# EAGLE schematic VoltMeter (EAGLE 9.4.1)
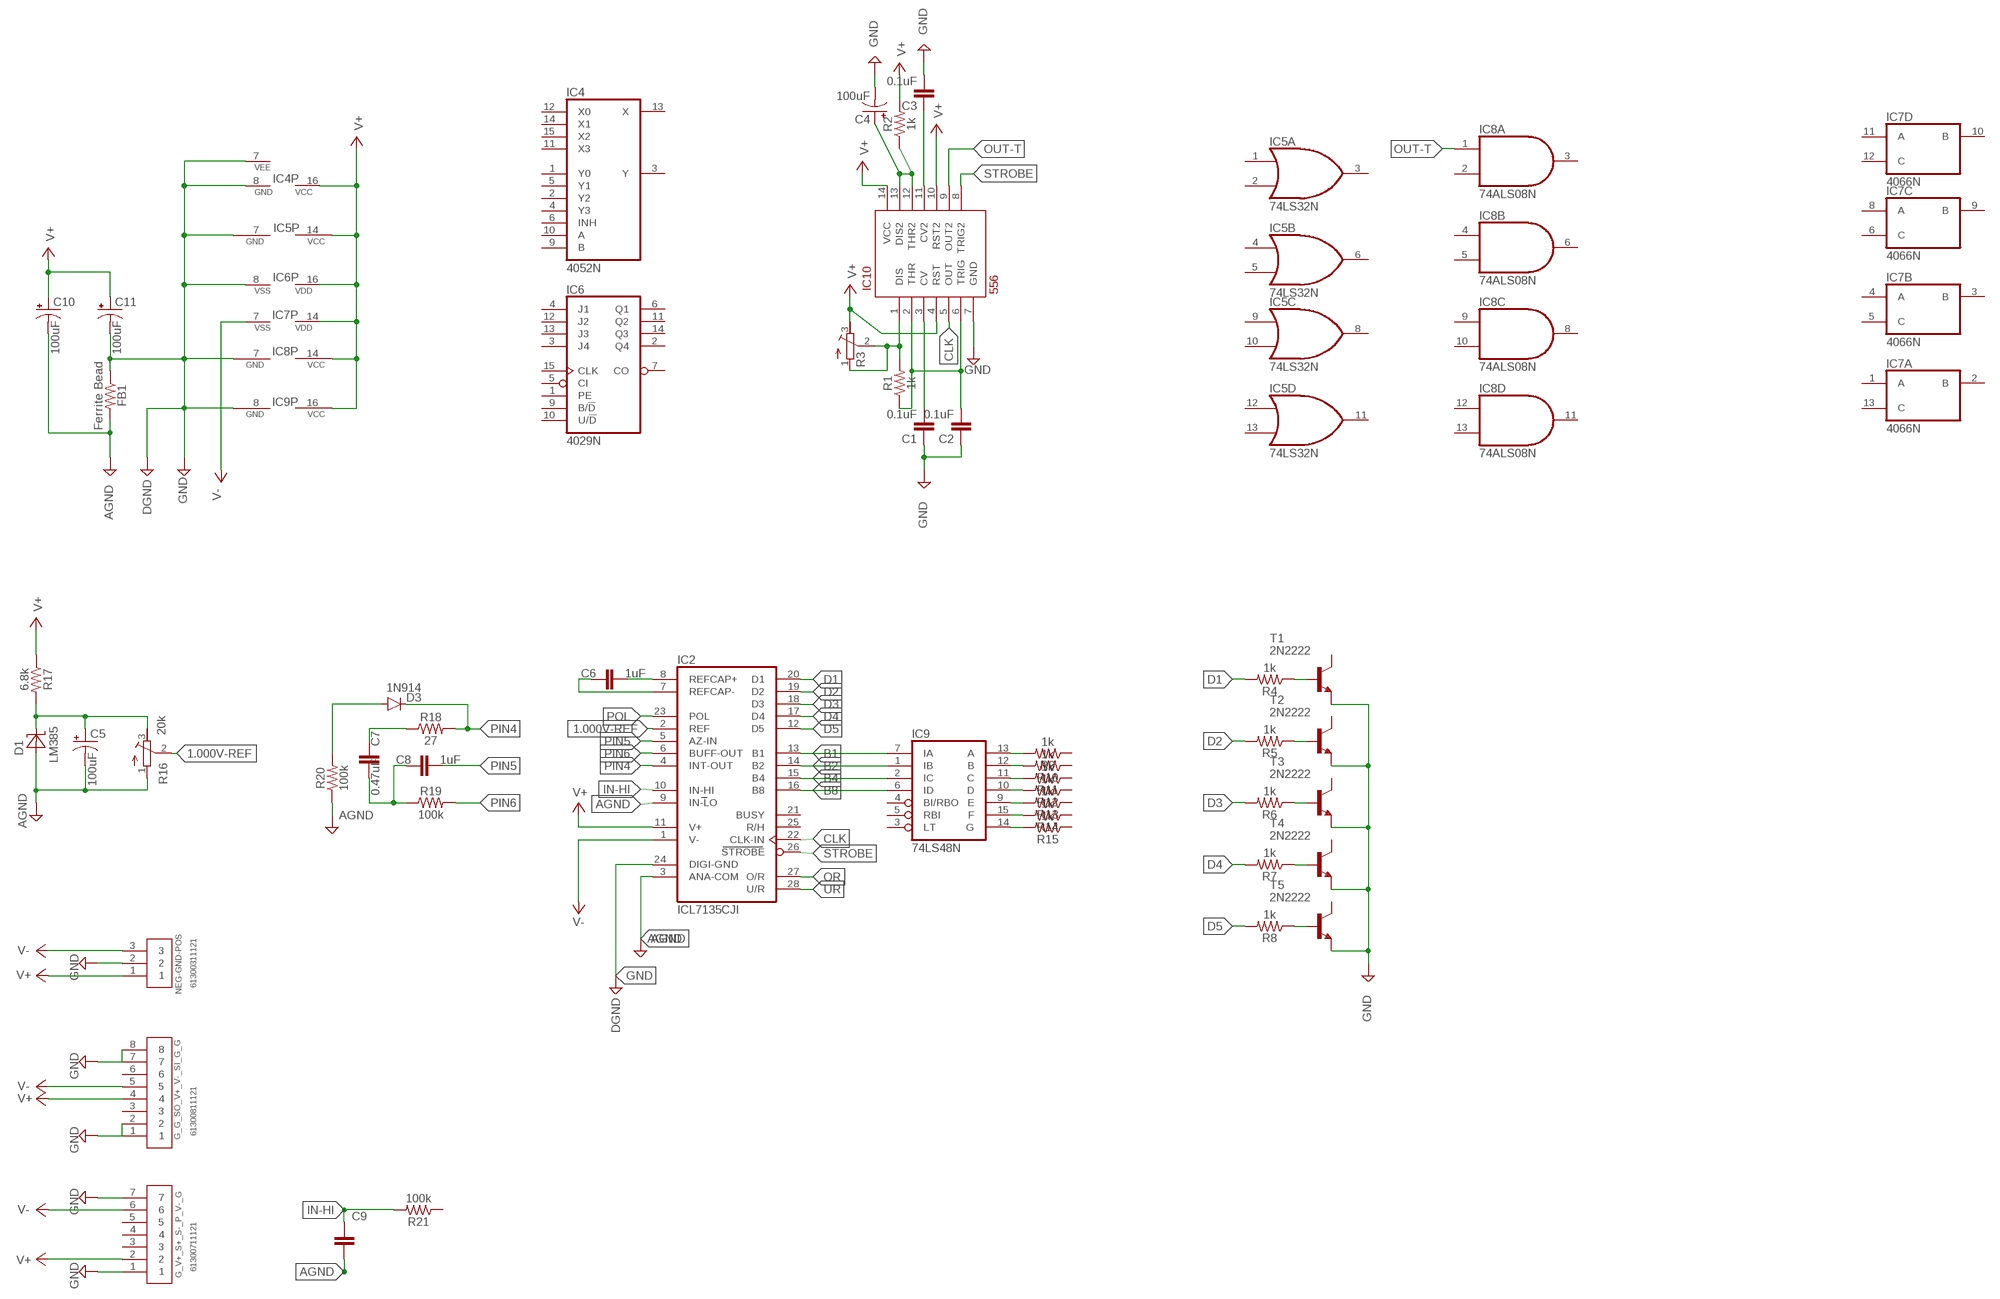
[diagram p0: schematic, sheet 1]

## Parts
C1  0.1uF  0.1UF-KIT-EZ-50V-20%  [CAP-PTH-SMALL-KIT]
C2  0.1uF  0.1UF-KIT-EZ-50V-20%  [CAP-PTH-SMALL-KIT]
C3  0.1uF  0.1UF-KIT-EZ-50V-20%  [CAP-PTH-SMALL-KIT]
C4  100uF  100UF-POLAR-RADIAL-2.5MM-25V-20%  [CPOL-RADIAL-2.5MM-6.5MM]
C5  100uF  100UF-POLAR-RADIAL-2.5MM-25V-20%  [CPOL-RADIAL-2.5MM-6.5MM]
C6  1uF  0.1UF-KIT-EZ-50V-20%  [CAP-PTH-SMALL-KIT]
C7  0.47uF  0.1UF-KIT-EZ-50V-20%  [CAP-PTH-SMALL-KIT]
C8  1uF  0.1UF-KIT-EZ-50V-20%  [CAP-PTH-SMALL-KIT]
C9  0.1uF  C5/2.5  [C5B2.5]
C10  100uF  100UF-POLAR-RADIAL-2.5MM-25V-20%  [CPOL-RADIAL-2.5MM-6.5MM]
C11  100uF  100UF-POLAR-RADIAL-2.5MM-25V-20%  [CPOL-RADIAL-2.5MM-6.5MM]
D1  LM385  [TO-92]
D3  1N914  1N4148DO35-7  [DO35-7]
FB1  Ferrite Bead  1KOHM-HORIZ-1/4W-5%  [AXIAL-0.3]
G_G_SO_V+_V-_SI_G_G  61300811121  [61300811121]
G_V+_S+_S-_P_V-_G  61300711121  [61300711121]
IC2  ICL7135CJI  [DIL28-6]
IC4  4052N  [DIL16]
IC5  74LS32N  [DIL14]
IC6  4029N  [DIL16]
IC7  4066N  [DIL14]
IC8  74ALS08N  [DIL14]
IC9  74LS48N  [DIL16]
IC10  556  [DIP14]
NEG-GND-POS  61300311121  [61300311121]
R1  1k  1KOHM-HORIZ-1/4W-1%  [AXIAL-0.3]
R2  1k  1KOHM-HORIZ-1/4W-1%  [AXIAL-0.3]
R3  R-TRIMM3299W  [RTRIM3299W]
R4  1k  1KOHM-HORIZ-1/4W-1%  [AXIAL-0.3]
R5  1k  1KOHM-HORIZ-1/4W-1%  [AXIAL-0.3]
R6  1k  1KOHM-HORIZ-1/4W-1%  [AXIAL-0.3]
R7  1k  1KOHM-HORIZ-1/4W-1%  [AXIAL-0.3]
R8  1k  1KOHM-HORIZ-1/4W-1%  [AXIAL-0.3]
R9  1k  1KOHM-HORIZ-1/4W-1%  [AXIAL-0.3]
R10  1k  1KOHM-HORIZ-1/4W-1%  [AXIAL-0.3]
R11  1k  1KOHM-HORIZ-1/4W-1%  [AXIAL-0.3]
R12  1k  1KOHM-HORIZ-1/4W-1%  [AXIAL-0.3]
R13  1k  1KOHM-HORIZ-1/4W-1%  [AXIAL-0.3]
R14  1k  1KOHM-HORIZ-1/4W-1%  [AXIAL-0.3]
R15  1k  1KOHM-HORIZ-1/4W-1%  [AXIAL-0.3]
R16  20k  R-TRIMM3299W  [RTRIM3299W]
R17  6.8k  1KOHM-HORIZ-1/4W-1%  [AXIAL-0.3]
R18  27  1KOHM-HORIZ-1/4W-1%  [AXIAL-0.3]
R19  100k  1KOHM-HORIZ-1/4W-1%  [AXIAL-0.3]
R20  100k  1KOHM-HORIZ-1/4W-1%  [AXIAL-0.3]
R21  100k  1KOHM-HORIZ-1/4W-1%  [AXIAL-0.3]
T1  2N2222  [TO92-EBC-OVAL]
T2  2N2222  [TO92-EBC-OVAL]
T3  2N2222  [TO92-EBC-OVAL]
T4  2N2222  [TO92-EBC-OVAL]
T5  2N2222  [TO92-EBC-OVAL]

## Nets
1.000V-REF: IC2.2(REF) R16.2(S)
AGND: C5.2(-) C9.2 C10.2(-) D1.+ FB1.P$2 IC2.3(ANA-COM) IC2.9(IN-LO) R16.1(A) R20.P$1
B1: IC2.13(B1) IC9.7(IA)
B2: IC2.14(B2) IC9.1(IB)
B4: IC2.15(B4) IC9.2(IC)
B8: IC2.16(B8) IC9.6(ID)
CLK: IC2.22(CLK-IN) IC10.5(OUT)
D1: IC2.20(D1) R4.P$2
D2: IC2.19(D2) R5.P$2
D3: IC2.18(D3) R6.P$2
D4: IC2.17(D4) R7.P$2
D5: IC2.12(D5) R8.P$2
GND: C1.1 C2.1 C3.2 C4.2(-) C11.2(-) FB1.P$1 G_G_SO_V+_V-_SI_G_G.1 G_G_SO_V+_V-_SI_G_G.2 G_G_SO_V+_V-_SI_G_G.7 G_G_SO_V+_V-_SI_G_G.8 G_V+_S+_S-_P_V-_G.1 G_V+_S+_S-_P_V-_G.7 IC2.24(DIGI-GND) IC4.7(VEE) IC4.8(GND) IC5.7(P:GND) IC6.8(VSS) IC8.7(P:GND) IC9.8(GND) IC10.7(GND) NEG-GND-POS.2 T1.E T2.E T3.E T4.E T5.E ; supply symbol labelled DGND
IN-HI: C9.1 IC2.10(IN-HI) R21.P$2
N$1: C2.2 IC10.2(THR) IC10.6(TRIG) R1.P$1
N$2: IC10.1(DIS) R1.P$2 R3.1(A) R3.2(S)
N$3: C4.1(+) IC10.12(THR2) IC10.13(DIS2) R2.P$1
N$4: C1.2 IC10.3(CV)
N$5: C3.1 IC10.11(CV2)
N$6: R4.P$1 T1.B
N$7: R5.P$1 T2.B
N$8: R6.P$1 T3.B
N$9: R7.P$1 T4.B
N$10: R8.P$1 T5.B
N$15: IC9.13(A) R9.P$2
N$16: IC9.12(B) R10.P$2
N$17: IC9.11(C) R11.P$2
N$18: IC9.10(D) R12.P$2
N$19: IC9.9(E) R13.P$2
N$20: IC9.15(F) R14.P$2
N$21: IC9.14(G) R15.P$2
N$22: C6.2 IC2.8(REFCAP+)
N$23: D3.A R20.P$2
N$24: C7.1 R18.P$1
N$25: C7.2 C8.1 R19.P$1
N$26: C6.1 IC2.7(REFCAP-)
OR: IC2.27(O/R)
OUT-T: IC8.1(A:I0) IC10.9(OUT2)
PIN4: D3.C IC2.4(INT-OUT) R18.P$2
PIN5: C8.2 IC2.5(AZ-IN)
PIN6: IC2.6(BUFF-OUT) R19.P$2
POL: IC2.23(POL)
STROBE: IC2.26(STROBE) IC10.8(TRIG2)
UR: IC2.28(U/R)
V+: C10.1(+) C11.1(+) G_G_SO_V+_V-_SI_G_G.4 G_V+_S+_S-_P_V-_G.2 IC2.11(V+) IC4.16(VCC) IC5.14(P:VCC) IC6.16(VDD) IC7.14(P:VDD) IC8.14(P:VCC) IC9.16(VCC) IC10.4(RST) IC10.10(RST2) IC10.14(VCC) NEG-GND-POS.1 R2.P$2 R3.3(E) R17.P$1
V-: G_G_SO_V+_V-_SI_G_G.5 G_V+_S+_S-_P_V-_G.6 IC2.1(V-) IC7.7(P:VSS) NEG-GND-POS.3
VREF-1.0V: C5.1(+) D1.- R16.3(E) R17.P$2
Unconnected: G_G_SO_V+_V-_SI_G_G.3 G_G_SO_V+_V-_SI_G_G.6 G_V+_S+_S-_P_V-_G.3 G_V+_S+_S-_P_V-_G.4 G_V+_S+_S-_P_V-_G.5 IC2.21(BUSY) IC2.25(R/H) IC4.1(Y0) IC4.2(Y2) IC4.3(Y) IC4.4(Y3) IC4.5(Y1) IC4.6(INH) IC4.9(B) IC4.10(A) IC4.11(X3) IC4.12(X0) IC4.13(X) IC4.14(X1) IC4.15(X2) IC5.1(A:I0) IC5.2(A:I1) IC5.3(A:O) IC5.4(B:I0) IC5.5(B:I1) IC5.6(B:O) IC5.8(C:O) IC5.9(C:I0) IC5.10(C:I1) IC5.11(D:O) IC5.12(D:I0) IC5.13(D:I1) IC6.1(PE) IC6.2(Q4) IC6.3(J4) IC6.4(J1) IC6.5(CI) IC6.6(Q1) IC6.7(CO) IC6.9(B/!D) IC6.10(U/!D) IC6.11(Q2) IC6.12(J2) IC6.13(J3) IC6.14(Q3) IC6.15(CLK) IC7.1(A:A) IC7.2(A:B) IC7.3(B:B) IC7.4(B:A) IC7.5(B:C) IC7.6(C:C) IC7.8(C:A) IC7.9(C:B) IC7.10(D:B) IC7.11(D:A) IC7.12(D:C) IC7.13(A:C) IC8.2(A:I1) IC8.3(A:O) IC8.4(B:I0) IC8.5(B:I1) IC8.6(B:O) IC8.8(C:O) IC8.9(C:I0) IC8.10(C:I1) IC8.11(D:O) IC8.12(D:I0) IC8.13(D:I1) IC9.3(LT) IC9.4(BI/RBO) IC9.5(RBI) R9.P$1 R10.P$1 R11.P$1 R12.P$1 R13.P$1 R14.P$1 R15.P$1 R21.P$1 T1.C T2.C T3.C T4.C T5.C

## Library data of the parts
C1-C3 = SparkFun-Capacitors:0.1UF: 0.1µF ceramic capacitors A capacitor is a passive two-terminal electrical component used to store electrical energy temporarily in an electric field.; PROD_ID: CAP-08370
C4 C5 C10 C11 = SparkFun-Capacitors:100UF-POLAR: 100µF polarized capacitors A capacitor is a passive two-terminal electrical component used to store electrical energy temporarily in an electric field.; PROD_ID: CAP-08439
C6-C8 = SparkFun-Capacitors:0.1UF: 0.1µF ceramic capacitors A capacitor is a passive two-terminal electrical component used to store electrical energy temporarily in an electric field.; PROD_ID: CAP-08370; VALUE: 0.1uF
C9 = capacitor-wima:C: CAPACITOR naming: grid - package width
D1 = lm385:LM385: LM385 LM385 Micropower Voltage Reference
D3 = diode:1N4148: DIODE high speed (Philips)
FB1 = SparkFun-Resistors:1KOHM: 1kΩ resistor A resistor is a passive two-terminal electrical component that implements electrical resistance as a circuit element. Resistors act to reduce current flow, and, at the same time, act to lower voltage levels within circuits. - Wikipedia; PROD_ID: RES-08380; VALUE: 1k
G_G_SO_V+_V-_SI_G_G = Headers:61300811121: CONN HEADER VERT 8POS 2.54MM Manufacturer's datasheet <https://katalog.we-online.de/em/datasheet/6130xx11121.pdf>; CREATED_BY: PCBLayout.com; DIGI_KEY_PART_NUMBER: 732-5321-ND; MANUFACTURER: Wurth Electronics Inc.; MPN: 61300811121
G_V+_S+_S-_P_V-_G = Headers:61300711121: CONN HEADER VERT 7POS 2.54MM Manufacturer's datasheet <https://katalog.we-online.de/em/datasheet/6130xx11121.pdf>; CREATED_BY: PCBLayout.com; DIGI_KEY_PART_NUMBER: 732-5320-ND; MANUFACTURER: Wurth Electronics Inc.; MPN: 61300711121
IC2 = maxim-9:ICL7135CJI: ANALOG/DIGITAL CONVERTER
IC4 = 40xx:4052: Dual 4-channel ANALOG MULTIPLEXER
IC5 = 74xx-us:74*32: Quad 2-input OR gate
IC6 = 40xx:4029: Binary/decimal up/down COUNTER
IC7 = 40xx:4066: Quad bilateral ANALOG SWITCH
IC8 = 74xx-us:74*08: Quad 2-input AND gate
IC9 = 74xx-us:74*48: BCD to seven segment DECODER/DRIVER
IC10 = SparkFun-IC-Special-Function:556: 556 Dual 555 timer 2 555 timers in one package 1MHZ 14DIP Datasheet <https://cdn.sparkfun.com/datasheets/Kits/icm7555-56.pdf> SparkFun Products SparkFun SparkPunk Sound Kit <https://www.sparkfun.com/products/11177> (KIT-11177); PROD_ID: IC-11898
NEG-GND-POS = Headers:61300311121: CONN HEADER VERT 3POS 2.54MM Manufacturer's datasheet <https://katalog.we-online.de/em/datasheet/6130xx11121.pdf>; CREATED_BY: PCBLayout.com; DIGI_KEY_PART_NUMBER: 732-5316-ND; MANUFACTURER: Wurth Electronics Inc.; MPN: 61300311121
R1 R2 R4-R15 = SparkFun-Resistors:1KOHM: 1kΩ resistor A resistor is a passive two-terminal electrical component that implements electrical resistance as a circuit element. Resistors act to reduce current flow, and, at the same time, act to lower voltage levels within circuits. - Wikipedia; PROD_ID: RES-12182
R3 R16 = resistor:R-TRIMM: Trimm resistor
R17-R21 = SparkFun-Resistors:1KOHM: 1kΩ resistor A resistor is a passive two-terminal electrical component that implements electrical resistance as a circuit element. Resistors act to reduce current flow, and, at the same time, act to lower voltage levels within circuits. - Wikipedia; PROD_ID: RES-12182; VALUE: 1k
T1-T5 = adafruit:2N2222: NPN TRANSISTOR Big oval pads